# EAGLE design lab8Edit2 (EAGLE 9.6.2)
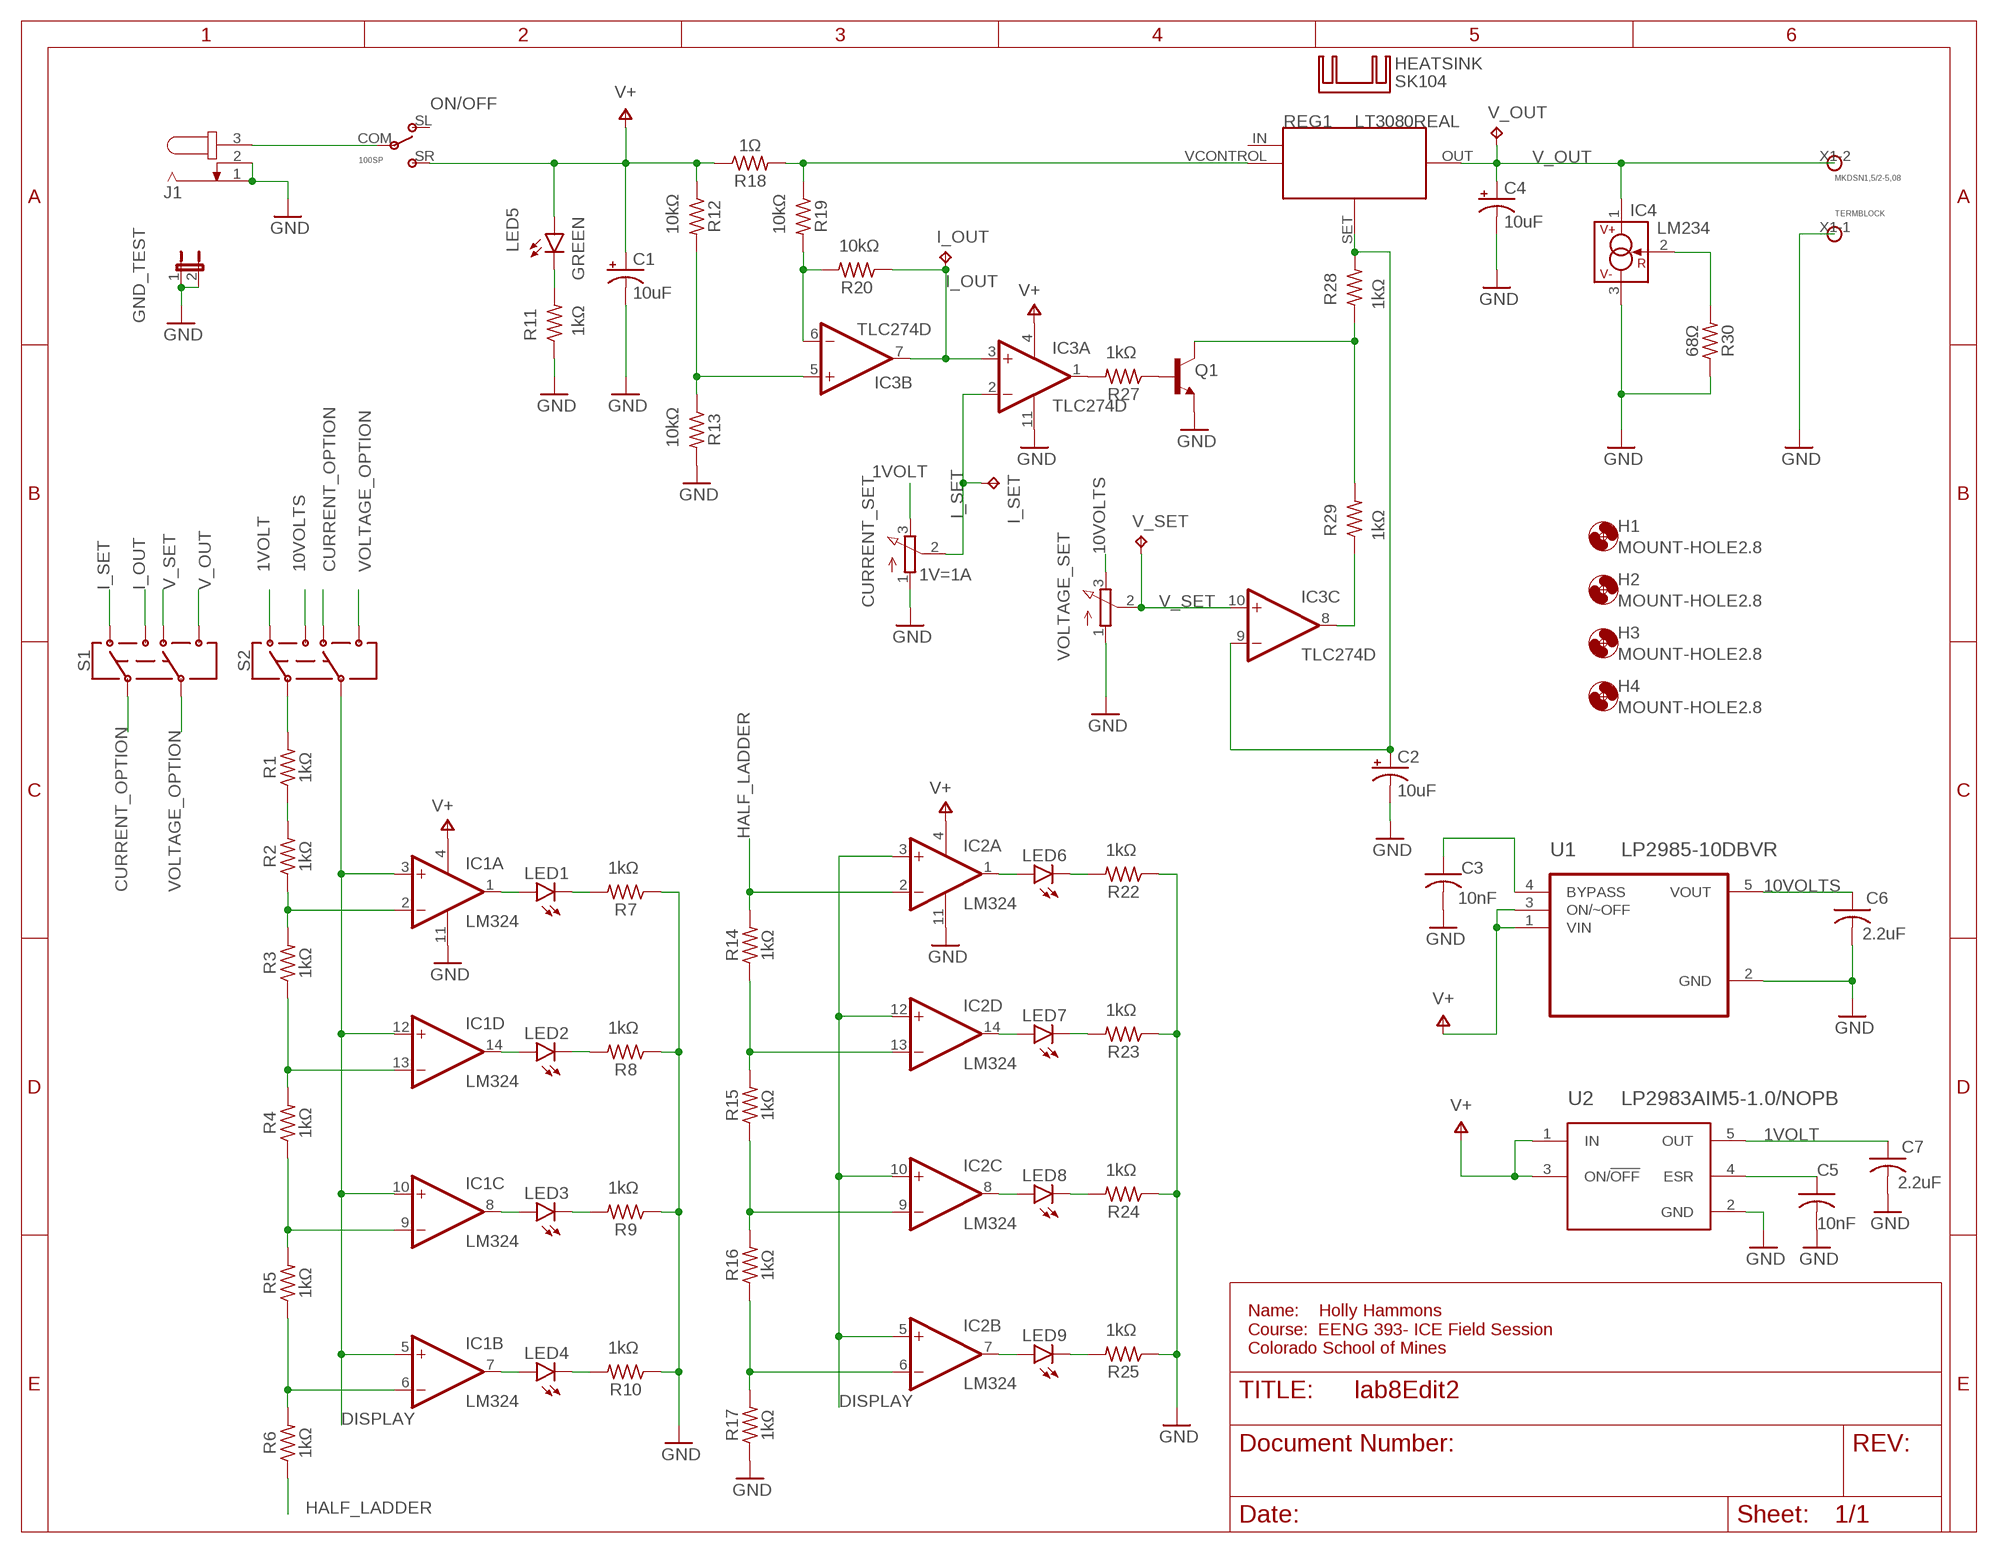
[diagram p0: schematic, sheet 1]

## Parts
C1  10uF  CPOL-USB  [PANASONIC_B]
C2  10uF  CPOL-USB  [PANASONIC_B]
C3  10nF  C-USC1206  [C1206]
C4  10uF  CPOL-USB  [PANASONIC_B]
C5  10nF  C-USC1206  [C1206]
C6  2.2uF  C-USC1206  [C1206]
C7  2.2uF  C-USC1206  [C1206]
CURRENT_SET  1V=1A  EVUF2A  [EVUF]
GND_TEST  JP1E  [JP1]
H1  MOUNT-HOLE2.8  [2,8]
H2  MOUNT-HOLE2.8  [2,8]
H3  MOUNT-HOLE2.8  [2,8]
H4  MOUNT-HOLE2.8  [2,8]
HEATSINK  SK104  [SK104]
I_OUT  TPPAD1-13  [P1-13]
I_SET  TPPAD1-13  [P1-13]
IC1  LM324  LM324D  [SO14]
IC2  LM324  LM324D  [SO14]
IC3  TLC274D  [SO14]
IC4  LM234  LM334Z  [TO92]
J1  JACK-PLUG0  [SPC4077]
LED1  LEDCHIPLED_1206  [CHIPLED_1206]
LED2  LEDCHIPLED_1206  [CHIPLED_1206]
LED3  LEDCHIPLED_1206  [CHIPLED_1206]
LED4  LEDCHIPLED_1206  [CHIPLED_1206]
LED5  GREEN  LEDCHIPLED_1206  [CHIPLED_1206]
LED6  LEDCHIPLED_1206  [CHIPLED_1206]
LED7  LEDCHIPLED_1206  [CHIPLED_1206]
LED8  LEDCHIPLED_1206  [CHIPLED_1206]
LED9  LEDCHIPLED_1206  [CHIPLED_1206]
MKDSN1,5/2-5,08  TERMBLOCK  [TERMBLOCK]
ON/OFF  100SP  [SP100]
Q1  TRANS_NPN-MMBTA42  [SOT23-3]
R1  1kΩ  R-US_R1206  [R1206]
R2  1kΩ  R-US_R1206  [R1206]
R3  1kΩ  R-US_R1206  [R1206]
R4  1kΩ  R-US_R1206  [R1206]
R5  1kΩ  R-US_R1206  [R1206]
R6  1kΩ  R-US_R1206  [R1206]
R7  1kΩ  R-US_R1206  [R1206]
R8  1kΩ  R-US_R1206  [R1206]
R9  1kΩ  R-US_R1206  [R1206]
R10  1kΩ  R-US_R1206  [R1206]
R11  1kΩ  R-US_R1206  [R1206]
R12  10kΩ  R-US_R1206  [R1206]
R13  10kΩ  R-US_R1206  [R1206]
R14  1kΩ  R-US_R1206  [R1206]
R15  1kΩ  R-US_R1206  [R1206]
R16  1kΩ  R-US_R1206  [R1206]
R17  1kΩ  R-US_R1206  [R1206]
R18  1Ω  R-US_0411/15  [0411/15]
R19  10kΩ  R-US_R1206  [R1206]
R20  10kΩ  R-US_R1206  [R1206]
R22  1kΩ  R-US_R1206  [R1206]
R23  1kΩ  R-US_R1206  [R1206]
R24  1kΩ  R-US_R1206  [R1206]
R25  1kΩ  R-US_R1206  [R1206]
R27  1kΩ  R-US_R1206  [R1206]
R28  1kΩ  R-US_R1206  [R1206]
R29  1kΩ  R-US_R1206  [R1206]
R30  68Ω  R-US_R1206  [R1206]
REG1  LT3080REAL  [LT3080REAL]
S1  SWITCH-DPDT-SMD-AYZ0202  [SWITCH_DPDT_SMD_AYZ0202]
S2  SWITCH-DPDT-SMD-AYZ0202  [SWITCH_DPDT_SMD_AYZ0202]
U1  LP2985-10DBVR  [SOT95P280X145-5N]
U2  LP2983AIM5-1.0/NOPB  [SOT95P280X145-5N]
V_OUT  TPPAD1-13  [P1-13]
V_SET  TPPAD1-13  [P1-13]
VOLTAGE_SET  EVUF2A  [EVUF]

## Nets
1VOLT: C7.1 CURRENT_SET.3(E) S2.3 U2.5(OUT)
10VOLTS: C6.1 S2.1 U1.5(VOUT) VOLTAGE_SET.3(E)
CURRENT_OPTION: S1.2 S2.6
DISPLAY: IC1.3(A:+IN) IC1.5(B:+IN) IC1.10(C:+IN) IC1.12(D:+IN) IC2.3(A:+IN) IC2.5(B:+IN) IC2.10(C:+IN) IC2.12(D:+IN) S2.5
GND: C1.- C2.- C3.2 C4.- C5.2 C6.2 C7.2 CURRENT_SET.1(A) GND_TEST.1 GND_TEST.2 IC1.11(P:V-) IC2.11(P:V-) IC3.11(P:V-) IC4.3(V-) J1.1 J1.2 MKDSN1,5/2-5,08.X1-1 Q1.2(E) R7.1 R8.1 R9.1 R10.1 R11.1 R13.2 R17.1 R22.1 R23.1 R24.1 R25.1 R30.1 U1.2(GND) U2.2(GND) VOLTAGE_SET.1(A)
HALF_LADDER: IC2.2(A:-IN) R6.1 R14.2
I_OUT: I_OUT.TP IC3.3(A:+IN) IC3.7(B:OUT) R20.1 S1.1
I_SET: CURRENT_SET.2(S) I_SET.TP IC3.2(A:-IN) S1.3
N$1: J1.3 ON/OFF.COM
N$2: LED5.C R11.2
N$3: C2.+ IC3.9(C:-IN) R28.2 REG1.SET
N$4: R1.2 S2.2
N$5: IC3.8(C:OUT) R29.1
N$6: Q1.3(C) R28.1 R29.2
N$7: Q1.1(B) R27.1
N$8: IC3.5(B:+IN) R12.2 R13.1
N$9: IC4.2(R) R30.2
N$10: R18.2 R19.1 REG1.VCONTROL(VCTL)
N$11: IC3.6(B:-IN) R19.2 R20.2
N$12: IC3.1(A:OUT) R27.2
N$15: LED2.C R8.2
N$16: IC1.6(B:-IN) R5.1 R6.2
N$17: IC1.9(C:-IN) R4.1 R5.2
N$18: IC1.13(D:-IN) R3.1 R4.2
N$19: IC1.2(A:-IN) R2.1 R3.2
N$20: R1.1 R2.2
N$21: C3.1 U1.4(BYPASS)
N$22: IC1.7(B:OUT) LED4.A
N$23: LED4.C R10.2
N$24: IC1.8(C:OUT) LED3.A
N$25: LED3.C R9.2
N$26: IC1.14(D:OUT) LED2.A
N$27: IC1.1(A:OUT) LED1.A
N$28: LED1.C R7.2
N$29: LED7.C R23.2
N$30: IC2.6(B:-IN) R16.1 R17.2
N$31: IC2.9(C:-IN) R15.1 R16.2
N$32: IC2.13(D:-IN) R14.1 R15.2
N$34: C5.1 U2.4(ESR)
N$36: IC2.7(B:OUT) LED9.A
N$37: LED9.C R25.2
N$38: IC2.8(C:OUT) LED8.A
N$39: LED8.C R24.2
N$40: IC2.14(D:OUT) LED7.A
N$41: IC2.1(A:OUT) LED6.A
N$42: LED6.C R22.2
V+: C1.+ IC1.4(P:V+) IC2.4(P:V+) IC3.4(P:V+) LED5.A ON/OFF.SR R12.1 R18.1 U1.1(VIN) U1.3(ON/~OFF) U2.1(IN) U2.3(ON/!OFF)
V_OUT: C4.+ IC4.1(V+) MKDSN1,5/2-5,08.X1-2 REG1.OUT S1.4 V_OUT.TP
V_SET: IC3.10(C:+IN) S1.6 V_SET.TP VOLTAGE_SET.2(S)
VOLTAGE_OPTION: S1.5 S2.4
Unconnected: IC3.12(D:+IN) IC3.13(D:-IN) IC3.14(D:OUT) ON/OFF.SL REG1.IN

## Notes on the sheet
- Name:    Holly Hammons   
  Course:  EENG 393- ICE Field Session
  Colorado School of Mines

## Library data of the parts
C1 C2 C4 = rcl:CPOL-US: POLARIZED CAPACITOR, American symbol; SPICEPREFIX: C
C3 C5-C7 = rcl:C-US: CAPACITOR, American symbol; SPICEPREFIX: C
CURRENT_SET VOLTAGE_SET = pot:EVU: 9 mm Square Rotary Potentiometers Source: Panasonic
GND_TEST = jumper:JP1E: JUMPER
H1-H4 = holes:MOUNT-HOLE: MOUNTING HOLE with drill center marker
HEATSINK = heatsink:SK104: HEATSINK manufacturer Fischer/distributor Buerklin
I_OUT I_SET V_OUT V_SET = testpad:TP: Test pad
IC1 IC2 = linear:LM324: OP AMP
IC3 = linear:TLC274: OP AMP
IC4 = linear:LM*34: 3-Terminal Adjustable Current Sources Source: www.national.com/pf/LM/LM334.html | LM134.pdf
J1 = con-jack:JACK-PLUG: DC POWER JACK Power Jack, DC, Right Angle, Through Hole, Rated 5A at 16VDC, PC Terminals Distributor: Farnell (www.Farnell.de) Drawing: 84N1161.pdf / 84N1162.pdf Manufacturer: SPC Technology (www.spctechnology.com) Type: SPC4077 / SPC 4078; OC_FARNELL: unknown; OC_NEWARK: unknown
LED1-LED9 = led:LED: LED OSRAM: - CHIPLED LG R971, LG N971, LY N971, LG Q971, LY Q971, LO R971, LY R971 LH N974, LH R974 LS Q976, LO Q976, LY Q976 LO Q996 - Hyper CHIPLED LW Q18S LB Q993, LB Q99A, LB R99A - SideLED LS A670, LO A670, LY A670, LG A670, LP A670 LB A673, LV A673, LT A673, LW A673 LH A674 LY A675 LS A676, LA A676, LO A676, LY A676, LW A676 LS A679, LY A679, LG A679 - Hyper Micro SIDELED® LS Y876, LA Y876, LO Y876, LY Y876 LT Y87S - SmartLED LW L88C, LW L88S LB L89C, LB L89S, LG L890 LS L89K, LO L89K, LY L89K LS L896, LA L896, LO L896, LY L896 - TOPLED LS T670, LO T670, LY T670, LG T670, LP T670 LSG T670, LSP T670, LSY T670, LOP T670, LYG T670 LG T671, LOG T671, LSG T671 LB T673, LV T673, LT T673, LW T673 LH T674 LS T676, LA T676, LO T676, LY T676, LB T676, LH T676, LSB T676, LW T676 LB T67C, LV T67C, LT T67C, LS T67K, LO T67K, LY T67K, LW E67C LS E67B, LA E67B, LO E67B, LY E67B, LB E67C, LV E67C, LT E67C LW T67C LS T679, LY T679, LG T679 LS T770, LO T770, LY T770, LG T770, LP T770 LB T773, LV T773, LT T773, LW T773 LH T774 LS E675, LA E675, LY E675, LS T675 LS T776, LA T776, LO T776, LY T776, LB T776 LHGB T686 LT T68C, LB T68C - Hyper Mini TOPLED® LB M676 - Mini TOPLED Santana® LG M470 LS M47K, LO M47K, LY M47K Source: http://www.osram.convergy.de LUXEON: - LUMILED® LXK2-PW12-R00, LXK2-PW12-S00, LXK2-PW14-U00, LXK2-PW14-V00 LXK2-PM12-R00, LXK2-PM12-S00, LXK2-PM14-U00 LXK2-PE12-Q00, LXK2-PE12-R00, LXK2-PE12-S00, LXK2-PE14-T00, LXK2-PE14-U00 LXK2-PB12-K00, LXK2-PB12-L00, LXK2-PB12-M00, LXK2-PB14-N00, LXK2-PB14-P00, LXK2-PB14-Q00 LXK2-PR12-L00, LXK2-PR12-M00, LXK2-PR14-Q00, LXK2-PR14-R00 LXK2-PD12-Q00, LXK2-PD12-R00, LXK2-PD12-S00 LXK2-PH12-R00, LXK2-PH12-S00 LXK2-PL12-P00, LXK2-PL12-Q00, LXK2-PL12-R00 Source: www.luxeon.com KINGBRIGHT: KA-3528ASYC Source: www.kingbright.com
MKDSN1,5/2-5,08 = hammons:TERMBLOCK
ON/OFF = hammons:100SP
Q1 = SparkFun-DiscreteSemi:TRANS_NPN: NPN transistor Current controlled devices typically used to amplify current or used as a switch. BC547 - COM-08928 <http://www.sparkfun.com/products/8928> (TO-92 45V 100mA) (1.Collector 2.Base 3.Emitter) 2N3904 - COM-00521 <http://www.sparkfun.com/products/521> (TO-92 40V 200mA) (1.Emitter 2.Base 3.Collector) P2N2222A - COM-12852 <http://www.sparkfun.com/products/12852> (TO-92 40V 600mA) (1.Collector 2.Base 3.Emitter); PROD_ID: TRANS-09116; VALUE: 500mA/300V
R1-R20 R22-R25 R27-R30 = rcl:R-US_: RESISTOR, American symbol; SPICEPREFIX: R
REG1 = hammons:LT3080REAL
S1 S2 = SparkFun-Switches:SWITCH-DPDT: Double-Pole, Double-Throw (DPDT) Switch Double-pole, double-throw switches. Variant Overview PTH-GPI-152-3013 Used on SparkFun Geiger Counter <https://www.sparkfun.com/products/11345> SMD-AY0202 Surface Mount DPDT Switch <https://www.sparkfun.com/products/597> (COM-00597) Used on e.g. LilyPad Arduino USB - ATmega32U4 Board <https://www.sparkfun.com/products/12049>; PROD_ID: SWCH-08179; SF_SKU: COM-00597
U1 = LP2985-10DBVR:LP2985-10DBVR: Check availability <https://pricing.snapeda.com/parts/LP2985-10DBVR/Texas%20Instruments/view-part?ref=eda>; AVAILABILITY: In Stock; DESCRIPTION: 150-mA, 16-V, low-dropout voltage regulator with enable; MF: Texas Instruments; MP: LP2985-10DBVR; PACKAGE: SOT-23-5 Texas Instruments; PRICE: None; PURCHASE-URL: https://pricing.snapeda.com/search/part/LP2985-10DBVR/?ref=eda
U2 = LP2983AIM5-1.0_NOPB:LP2983AIM5-1.0/NOPB: 150-mA, 16-V, low-dropout voltage regulator with low output voltage & enable 5-SOT-23 -40 to 125 Check availability <https://pricing.snapeda.com/parts/LP2983AIM5-1.0/NOPB/Texas%20Instruments/view-part?ref=eda>; AVAILABILITY: In Stock; DESCRIPTION: 150-mA, 16-V, low-dropout voltage regulator with low output voltage & enable; MF: Texas Instruments; MP: LP2983AIM5-1.0/NOPB; PACKAGE: SOT-23-5 Texas Instruments; PRICE: None; PURCHASE-URL: https://pricing.snapeda.com/search/part/LP2983AIM5-1.0/NOPB/?ref=eda

## Board
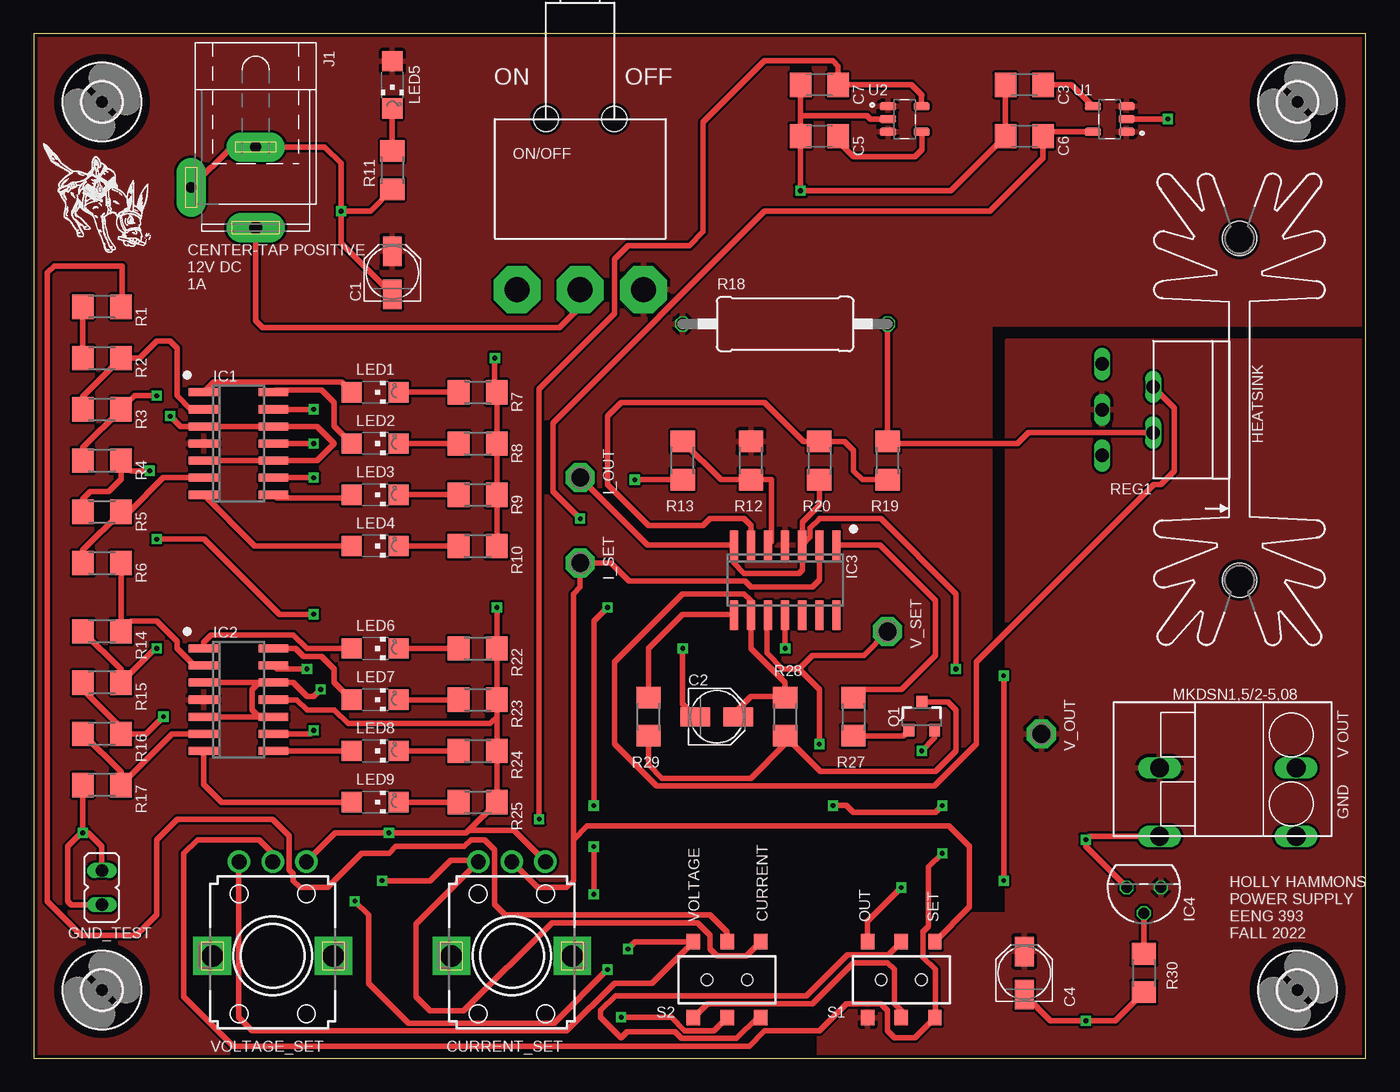
[diagram p1: board, top side]
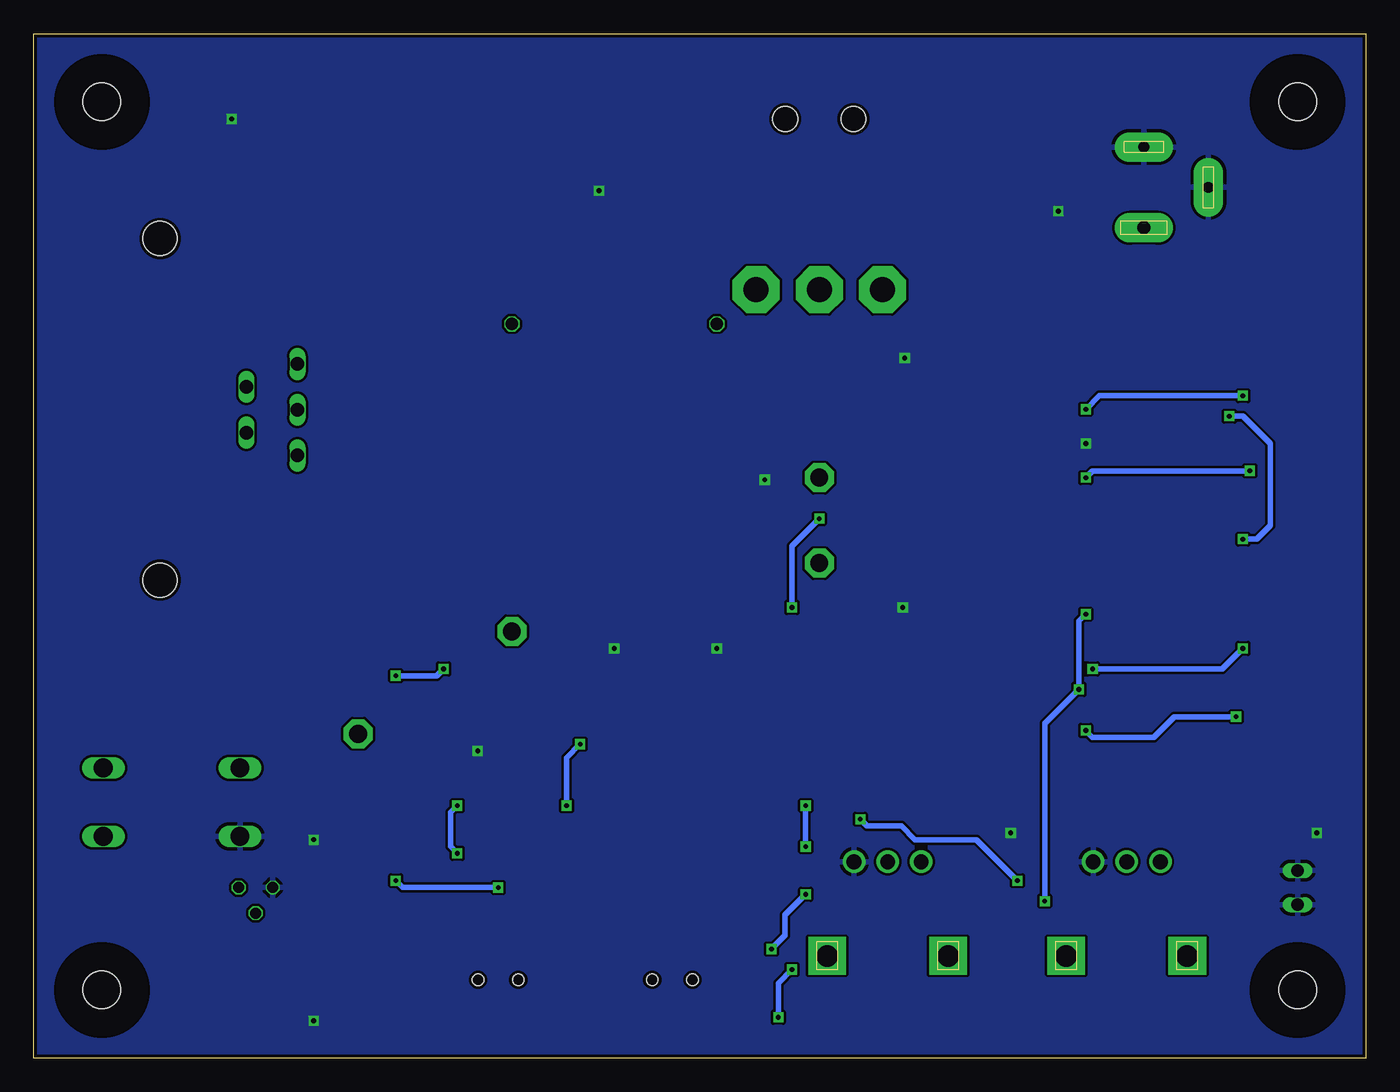
[diagram p2: board, bottom side, seen from below]

Size 99.06 x 76.2 mm. Coordinates in mm from the lower left corner, seen from the top.
Outline: 0,0 99.06,0 99.06,76.2 0,76.2 0,0
Copper layers (1*16): Top 0.0356mm / dielectric 1.5011mm / Bottom 0.0356mm
Design rules "SilverCircuits": minimum track width 7mil, minimum drill 10mil, track to track 7mil, track to pad 7mil, pad to pad 7mil, via to via 7mil, smd to smd 0mil, copper to edge 10mil, drill to drill 10mil, minimum pad ring 4mil, minimum via ring 8mil, stop-mask expansion 4mil, vias tented up to drill 0mil, thermal gap 10mil

### Footprints (pad centres in the part's own frame; a part is rotated, then mirrored left to right if it is on the bottom)
PANASONIC_B = smd 2.2 x 1.4: + 1.6,0; - -1.6,0
C1206 = smd 1.6 x 1.8: 1 -1.4,0; 2 1.4,0
EVUF = drill 1.1 pad 1.676: 1 -2.5,-7; 2 0,-7; 3 2.5,-7 | drill 1.6 pad 2.8 square: M1 4.5,0; M2 -4.5,0
JP1 = drill 0.914 long: 1 0,-1.27; 2 0,1.27
2,8 = hole 2.8: 0,0
SK104 = hole 2.54: -12.7,-0.762; 12.7,-0.762
P1-13 = drill 1.321 pad 2.159 octagon: TP 0,0
SO14 = smd 0.6 x 2.2: 1 -3.81,-2.6; 2 -2.54,-2.6; 3 -1.27,-2.6; 4 0,-2.6; 5 1.27,-2.6; 6 2.54,-2.6; 7 3.81,-2.6; 8 3.81,2.6; 9 2.54,2.6; 10 1.27,2.6; 11 0,2.6; 12 -1.27,2.6; 13 -2.54,2.6; 14 -3.81,2.6
TO92 = drill 0.813 octagon: 1 -1.27,0; 2 0,1.905; 3 1.27,0
SPC4077 = drill 0.8 pad 2.184 long: 1 -3,0; 2 0,-4.8 | drill 1 pad 2.184 long: 3 3,0
CHIPLED_1206 = smd 1.5 x 1.5: A 0,-1.75; C 0,1.75
TERMBLOCK = drill 1.4 long: P$3 0,2.64; P$4 5.08,2.64; X1-1 0,12.8; X1-2 5.08,12.8
SP100 = drill 1.85 pad 3.5 octagon: COM 0,-12.7; SL -4.7,-12.7; SR 4.7,-12.7 | hole 1.85: -2.54,0; 2.54,0
SOT23-3 = smd 0.8 x 0.9: 1 -0.95,-1; 2 0.95,-1; 3 0,1.1
R1206 = smd 1.6 x 1.803: 1 -1.422,0; 2 1.422,0
0411/15 = drill 0.914 octagon: 1 -7.62,0; 2 7.62,0
LT3080REAL = drill 1 long: IN 8.512,-8.191; NC$1 1.712,-8.191; OUT 5.112,-8.191; SET 3.412,-4.381; VCONTROL 6.812,-4.381
SWITCH_DPDT_SMD_AYZ0202 = smd 1 x 1.15: 1 -2.5,2.825; 2 0,2.825; 3 2.5,2.825; 4 -2.5,-2.825; 5 0,-2.825; 6 2.5,-2.825 | hole 0.85: 1.5,0; -1.5,0
SOT95P280X145-5N = smd 1.21 x 0.59: 1 -1.255,0.95; 2 -1.255,0; 3 -1.255,-0.95; 4 1.255,-0.95; 5 1.255,0.95

### Placement (x,y rotation side)
C1  26.67,58.42 90 top
C2  50.8,25.4 0 top
C3  73.66,72.39 180 top
C4  73.66,6.35 90 top
C5  58.42,68.58 180 top
C6  73.66,68.58 180 top
C7  58.42,72.39 180 top
CURRENT_SET  35.56,7.62 180 top
GND_TEST  5.08,12.7 180 top
H1  5.08,5.08 0 top
H2  93.98,71.12 0 top
H3  93.98,5.08 0 top
H4  5.08,71.12 0 top
HEATSINK  88.9,48.26 90 top
I_OUT  40.64,43.18 0 top
I_SET  40.64,36.83 0 top
IC1  15.24,45.72 270 top
IC2  15.24,26.67 270 top
IC3  55.88,35.56 180 top
IC4  82.55,12.7 180 top
J1  16.51,64.77 270 top
LED1  25.4,49.53 270 top
LED2  25.4,45.72 270 top
LED3  25.4,41.91 270 top
LED4  25.4,38.1 270 top
LED5  26.67,72.39 180 top
LED6  25.4,30.48 270 top
LED7  25.4,26.67 270 top
LED8  25.4,22.86 270 top
LED9  25.4,19.05 270 top
MKDSN1,5/2-5,08  96.52,16.51 90 top
ON/OFF  40.64,69.85 0 top
Q1  66.04,25.4 0 top
R1  5.08,55.88 0 top
R2  5.08,52.07 180 top
R3  5.08,48.26 180 top
R4  5.08,44.45 180 top
R5  5.08,40.64 180 top
R6  5.08,36.83 180 top
R7  33.02,49.53 180 top
R8  33.02,45.72 180 top
R9  33.02,41.91 180 top
R10  33.02,38.1 180 top
R11  26.67,66.04 90 top
R12  53.34,44.45 270 top
R13  48.26,44.45 270 top
R14  5.08,31.75 0 top
R15  5.08,27.94 0 top
R16  5.08,24.13 0 top
R17  5.08,20.32 0 top
R18  55.88,54.61 0 top
R19  63.5,44.45 270 top
R20  58.42,44.45 90 top
R22  33.02,30.48 180 top
R23  33.02,26.67 180 top
R24  33.02,22.86 180 top
R25  33.02,19.05 180 top
R27  60.96,25.4 90 top
R28  55.88,25.4 90 top
R29  45.72,25.4 270 top
R30  82.55,6.35 90 top
REG1  87.63,53.34 270 top
S1  64.52,5.84 0 top
S2  51.56,5.84 0 top
U1  80.01,69.85 180 top
U2  64.77,69.85 0 top
V_OUT  74.93,24.13 0 top
V_SET  63.5,31.75 0 top
VOLTAGE_SET  17.78,7.62 180 top

### Tracks (layer width: path | path; a pad name or v marks a point on that pad's centre or on a via)
1VOLT  (via drill 0.35)
  Top 0.406: v25.91,13.21 29.46,13.21 30.99,14.73 32.95,14.73 CURRENT_SET.3 28.45,10.01 28.45,4.57 29.5,3.52 31.97,3.52 38.53,10.08 49.35,10.08 50.29,9.14 50.29,8.13 50.8,7.62 53.02,7.62 S2.3 | U2.5 66.03,71.61 66.04,71.63 65.28,72.39 60.07,72.39 59.95,72.26 C7.1 59.82,73.78 59.44,74.17 54.36,74.17 49.78,69.6 49.78,61.47 48.77,60.45 44.2,60.45 43.18,59.44 43.18,55.37 37.59,49.78 v37.59,17.78
  Bottom 0.406: v37.59,17.78 37.08,17.27 34.54,17.27 33.53,16.26 28.96,16.26 v25.91,13.21
10VOLTS  (via drill 0.35)
  Top 0.406: U1.5 75.38,68.9 C6.1 75.06,66.93 71.12,62.99 54.36,62.99 38.61,47.24 38.61,42.16 v40.64,40.13 | VOLTAGE_SET.3 15.24,14.58 15.24,3.05 16.26,2.03 39.62,2.03 43.18,5.59 45.98,5.59 S2.1 44.73,8.67 v44.2,8.13 | v42.67,33.53 41.66,32.51 v41.66,18.8 | v41.66,15.75 v41.66,12.19
  Bottom 0.406: v44.2,8.13 43.18,9.14 43.18,10.67 v41.66,12.19 | v40.64,40.13 42.67,38.1 v42.67,33.53 | v41.66,18.8 v41.66,15.75
CURRENT_OPTION
  Top 0.406: S1.2 63.55,7.7 60.53,7.7 57.48,4.65 43.26,4.65 42.16,3.56 42.16,3.05 43.69,1.52 44.12,1.96 47.68,1.96 48.16,1.48 52.28,1.48 53.82,3.02 S2.6
DISPLAY  (via drill 0.35)
  Top 0.406: v10.16,47.75 10.92,46.99 IC1.3 IC1.12 21.08,46.99 22.35,45.72 21.08,44.45 IC1.10 IC1.5 | IC2.5 IC2.10 16.76,25.4 16.26,25.91 16.26,27.43 16.76,27.94 | 16.76,27.94 IC2.12 19.3,27.94 20.32,26.92 20.83,26.92 v21.34,27.43 | 16.76,27.94 IC2.3 | v43.69,3.05 47.42,3.05 48.4,2.06 50.61,2.06 S2.5 | v9.14,38.61 12.7,38.61 18.29,33.02 v20.83,33.02 | v23.88,11.68 24.89,10.67 24.89,5.59 27.86,2.62 38.68,2.62 v42.67,6.6
  Bottom 0.406: v10.16,47.75 9.14,47.75 7.11,45.72 7.11,39.62 8.13,38.61 v9.14,38.61 | v23.88,11.68 23.88,24.89 v21.34,27.43 21.34,32.51 v20.83,33.02 | v42.67,6.6 43.69,5.59 v43.69,3.05
GND  (via drill 0.35)
  Top 0.406: 34.44,25.4 R24.1 R25.1 32.33,16.94 | 34.44,25.4 R23.1 R22.1 v34.44,33.53 | R10.1 R9.1 R8.1 R7.1 34.29,49.68 v34.29,52.07 | R17.1 v3.66,16.76 | GND_TEST.1 5.08,15.75 4.06,16.76 v3.66,16.76 | IC1.11 v20.83,45.72 | R11.1 25.04,62.99 v22.86,62.99 | v22.86,62.99 22.86,66.55 21.64,67.77 J1.1 14.71,67.77 J1.2 | C1.- 22.86,60.63 v22.86,62.99 | C7.2 57.02,70.1 | 57.02,70.1 C5.2 v57.02,64.52 68.2,64.52 C6.2 C3.2 | U2.2 62.23,69.85 61.98,70.1 57.02,70.1 | U1.2 v84.33,69.85 | R13.2 v44.7,43.03 | Q1.2 66.99,23.81 v66.04,22.86 | IC3.11 v55.88,30.48 | C2.- 48.26,26.34 v48.26,30.48 | GND_TEST.2 2.79,11.43 2.54,11.68 2.54,15.75 3.56,16.76 v3.66,16.76 | VOLTAGE_SET.1 22.42,16.76 v26.42,16.76 32.16,16.76 32.33,16.94 | CURRENT_SET.1 35.74,16.94 32.33,16.94 | C4.- 75.62,2.79 v78.23,2.79 80.42,2.79 R30.1 | IC2.11 19.56,26.67 20.32,25.91 22.35,25.91 23.37,24.89 33.93,24.89 34.44,25.4 | IC4.3 78.23,15.75 v78.23,16.26 78.49,16.51 MKDSN1,5/2-5,08.X1-1
  pour Bottom: 0,0 0,76.2 99.06,76.2 99.06,0
HALF_LADDER
  Top 0.406: R6.1 R14.2 7.26,32.51 9.14,32.51 10.67,30.99 10.67,30.48 11.94,29.21 IC2.2
I_OUT  (via drill 0.35)
  Top 0.406: R20.1 58.42,41.15 57.15,39.88 IC3.3 | I_OUT.TP 45.66,38.16 IC3.7 52.07,36.83 52.83,36.07 56.9,36.07 57.15,36.32 IC3.3 | IC3.3 57.74,38.75 57.74,39.42 58.42,40.1 58.42,40.13 62.99,40.13 68.58,34.54 v68.58,28.96 | v72.14,28.45 v72.14,13.21 | v64.52,12.7 62.02,10.2 S1.1
  Bottom 0.406: v68.58,28.96 69.09,28.45 v72.14,28.45 | v72.14,13.21 71.63,12.7 v64.52,12.7
I_SET
  Top 0.406: CURRENT_SET.2 37.48,12.7 39.62,12.7 40.13,13.21 40.13,16.26 | 40.13,16.26 40.13,34.54 40.64,35.05 I_SET.TP 42.93,36.83 44.27,35.48 52.91,35.48 53.34,35.05 57.91,35.05 58.42,35.56 IC3.2 | S1.3 69.6,11.25 69.6,15.75 68.07,17.27 41.15,17.27 40.13,16.26
N$1
  Top 0.406: J1.3 16.51,54.86 17.02,54.36 39.12,54.36 40.64,55.88 ON/OFF.COM
N$2
  Top 0.406: LED5.C R11.2
N$3
  Top 0.406: C2.+ 52.4,25.98 53.34,26.92 55.78,26.92 R28.2 55.88,27.94 53.34,30.48 IC3.9 53.34,34.04 52.83,34.54 48.26,34.54 43.18,29.46 43.18,23.37 46.3,20.24 66.98,20.24 70.1,23.37 70.1,29.46 83.31,42.67 83.82,42.67 84.84,43.69 84.84,48.34 REG1.SET
N$4
  Top 0.406: R1.2 6.6,55.98 6.6,58.93 1.52,58.93 1.02,58.42 1.02,11.68 3.56,9.14 7.62,9.14 9.14,10.67 9.14,16.26 10.67,17.78 17.78,17.78 19,16.56 19,14.02 19.3,13.72 19.3,13.21 19.81,12.7 21.84,12.7 24.38,15.24 26.42,15.24 26.92,15.75 32,15.75 32.51,16.26 33.53,16.26 34.28,15.51 34.28,11.68 34.28,11.44 35.05,10.67 50.29,10.67 51.56,9.4 S2.2
N$5
  Top 0.406: R29.1 45.72,30.48 48.26,33.02 52.01,33.02 IC3.8
N$6
  Top 0.406: R29.2 45.72,21.84 46.74,20.83 53.34,20.83 55.88,23.37 R28.1 58.52,21.34 67.06,21.34 68.58,22.86 68.58,25.91 67.99,26.5 Q1.3
N$7
  Top 0.406: R27.1 64.67,23.98 Q1.1
N$8
  Top 0.406: R13.1 51.1,43.03 R12.2 54.86,43.03 54.86,38.41 IC3.5
N$9
  Top 0.406: IC4.2 R30.2
N$10
  Top 0.406: R18.2 R19.1 63.65,45.72 73.15,45.72 73.96,46.53 REG1.VCONTROL
N$11
  Top 0.406: R19.2 61.62,43.03 60.96,43.69 60.96,45.21 60.3,45.87 R20.2 57.25,45.87 54.36,48.77 43.69,48.77 42.67,47.75 42.67,42.67 45.72,39.62 49.78,39.62 50.29,40.13 52.83,40.13 53.34,39.62 IC3.6
N$12
  Top 0.406: R27.2 61.57,27.43 64.52,27.43 67.06,29.97 67.06,34.04 62.93,38.16 IC3.1
N$15
  Top 0.406: LED2.C R8.2
N$16
  Top 0.406: R6.2 3.66,37.8 R5.1 7.11,40.64 9.65,43.18 IC1.6
N$17  (via drill 0.35)
  Top 0.406: R5.2 3.66,41.61 4.22,42.16 5.59,42.16 6.5,43.08 R4.1 7.26,43.69 v8.64,43.69 | v20.83,43.18 IC1.9
  Bottom 0.406: v8.64,43.69 20.32,43.69 v20.83,43.18
N$18  (via drill 0.35)
  Top 0.406: R4.2 3.66,45.42 R3.1 7.52,49.28 v9.14,49.28 | v20.83,48.26 IC1.13
  Bottom 0.406: v20.83,48.26 19.81,49.28 v9.14,49.28
N$19
  Top 0.406: R3.2 3.66,49.23 R2.1 7.87,52.07 9.14,53.34 10.16,53.34 10.67,52.83 10.67,49.28 11.68,48.26 IC1.2
N$20
  Top 0.406: R1.1 R2.2
N$21
  Top 0.406: C3.1 77.17,72.39 U1.4
N$22
  Top 0.406: LED4.A 16.45,38.1 IC1.7
N$23
  Top 0.406: LED4.C R10.2
N$24
  Top 0.406: LED3.A 23.4,41.66 18.09,41.66 IC1.8
N$25
  Top 0.406: LED3.C R9.2
N$26
  Top 0.406: LED2.A 22.35,47.02 22.35,48.77 21.41,49.71 18.02,49.71 IC1.14
N$27
  Top 0.406: LED1.A 22.89,50.29 13.4,50.29 IC1.1
N$28
  Top 0.406: LED1.C R7.2
N$29
  Top 0.406: LED7.C R23.2
N$30
  Top 0.406: R16.1 6.5,21.29 R17.2 10.31,24.13 IC2.6
N$31  (via drill 0.35)
  Top 0.406: R15.1 3.66,27.43 6.5,24.59 R16.2 8.38,24.13 v9.65,25.4 | v20.83,24.38 20.57,24.13 IC2.9
  Bottom 0.406: v9.65,25.4 14.22,25.4 15.75,23.88 20.32,23.88 v20.83,24.38
N$32  (via drill 0.35)
  Top 0.406: R14.1 6.5,28.91 R15.2 9.04,30.48 v9.14,30.48 | v20.32,28.96 18.09,28.96 IC2.13
  Bottom 0.406: v9.14,30.48 10.67,28.96 v20.32,28.96
N$34
  Top 0.406: U2.4 66.04,68.89 66.04,67.56 65.53,67.06 60.96,67.06 59.82,68.2 C5.1
N$36
  Top 0.406: IC2.7 12.64,20.38 13.97,19.05 LED9.A
N$37
  Top 0.406: LED9.C R25.2
N$38
  Top 0.406: LED8.A IC2.8
N$39
  Top 0.406: LED8.C R24.2
N$40
  Top 0.406: LED7.A 22.35,27.97 22.35,28.96 21.41,29.9 20.08,29.9 19.49,30.48 IC2.14
N$41
  Top 0.406: LED6.A 20.32,30.48 19.3,31.5 13.21,31.5 12.64,30.93 IC2.1
N$42
  Top 0.406: LED6.C R22.2
V+
  pour Top: 57.15,0 57.15,10.16 57.15,11.43 71.12,11.43 71.12,54.61 99.06,54.61 99.06,76.2 0,76.2 0,0
V_OUT
  pour Top: 58.42,0 58.42,10.67 72.39,10.67 72.39,53.34 99.06,53.34 99.06,0
V_SET  (via drill 0.35)
  Top 0.406: VOLTAGE_SET.2 17.78,15.24 16.76,16.26 12.19,16.26 11.18,15.24 11.18,4.57 14.86,0.89 53.22,0.89 54.36,2.03 58.42,2.03 60.45,4.06 62.99,4.06 63.5,3.56 63.5,2.03 64.01,1.52 65.52,1.52 S1.6 67.06,3.06 67.06,6.6 66.14,7.53 66.14,9.4 66.55,9.81 66.55,14.22 v67.56,15.24 | 56.9,28.96 58.42,27.43 v58.42,23.37 | IC3.10 54.52,32.87 54.52,30.13 55.69,28.96 56.9,28.96 | V_SET.TP 61.72,29.97 57.91,29.97 56.9,28.96 | v59.44,18.8 60.45,18.8 60.96,18.29 67.06,18.29 v67.56,18.8
  Bottom 0.406: v58.42,23.37 59.44,22.35 v59.44,18.8 | v67.56,18.8 68.07,18.29 68.07,15.75 v67.56,15.24
VOLTAGE_OPTION
  Top 0.406: S2.4 50.11,4.06 57.91,4.06 60.96,7.11 63.5,7.11 64.01,6.6 64.01,4.06 64.52,3.56 S1.5

### Text on the board
tPlace: ON | OFF | V OUT | GND | HOLLY HAMMONS | POWER SUPPLY | EENG 393 | FALL 2022
tNames: CENTER-TAP POSITIVE | 12V DC | 1A | VOLTAGE | CURRENT | OUT | SET
vectorEngrave: ON | OFF | I_OUT | I_SET | V_SET | V OUT | V_OUT | GND | HOLLY HAMMONS | POWER SUPPLY | VOLTAGE | CURRENT | OUT | SET | EENG 393 | GND_TEST | FALL 2022 | VOLTAGE_SET | CURRENT_SET